# EAGLE schematic EAA690_RFID_v2 (EAGLE 7.3.0)
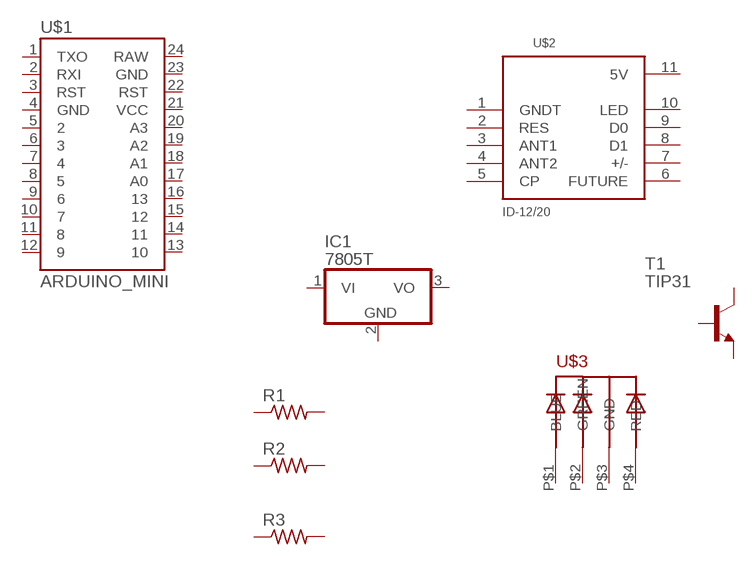
[diagram p0: schematic, sheet 1]

## Parts
IC1  7805T  [TO220H]
R1  R-US_0617/22  [0617/22]
R2  R-US_0617/22  [0617/22]
R3  R-US_0617/22  [0617/22]
T1  TIP31  [TO220]
U$1  ARDUINO_MINI  [ARDUINO_MINI]
U$2  ID-12/20  [ID-12]
U$3  5MMRGBLED  [LED5MMRGB]
Unconnected: IC1.1(VI) IC1.2(GND) IC1.3(VO) R1.1 R1.2 R2.1 R2.2 R3.1 R3.2 T1.1(B) T1.2(C) T1.3(E) U$1.1(TXO) U$1.2(RXI) U$1.3(RST) U$1.4(GND) U$1.5 U$1.6 U$1.7 U$1.8 U$1.9 U$1.10 U$1.11 U$1.12 U$1.13 U$1.14 U$1.15 U$1.16 U$1.17(A0) U$1.18(A1) U$1.19(A2) U$1.20(A3) U$1.21(VCC) U$1.22(RST) U$1.23(GND) U$1.24(RAW) U$2.1(GNDT) U$2.2(RES) U$2.3(ANT1) U$2.4(ANT2) U$2.5(CP) U$2.6(FUTURE) U$2.7(+/-) U$2.8(D1) U$2.9(D0) U$2.10(LED) U$2.11(5V) U$3.P$1(BLUE) U$3.P$2(GREEN) U$3.P$3(GND) U$3.P$4(RED)

## Library data of the parts
IC1 = linear:78*: Positive VOLTAGE REGULATOR Source: http://cache.national.com/ds/LM/LM78L05.pdf http://www.fairchildsemi.com/ds/LM/LM7805.pdf
R1-R3 = resistor:R-US_: RESISTOR, American symbol
T1 = transistor:TIP31: NPN Transistor Medium Power Linear Switching Applications Source: http://onsemi.com
U$1 = SparkFun-Boards:ARDUINO_MINI: Arduino Pro Mini footprint
U$2 = SparkFun-RF:ID-12/20: RFID reader for ID2, ID12, and ID20 Package
U$3 = led_rgb:5MMRGBLED